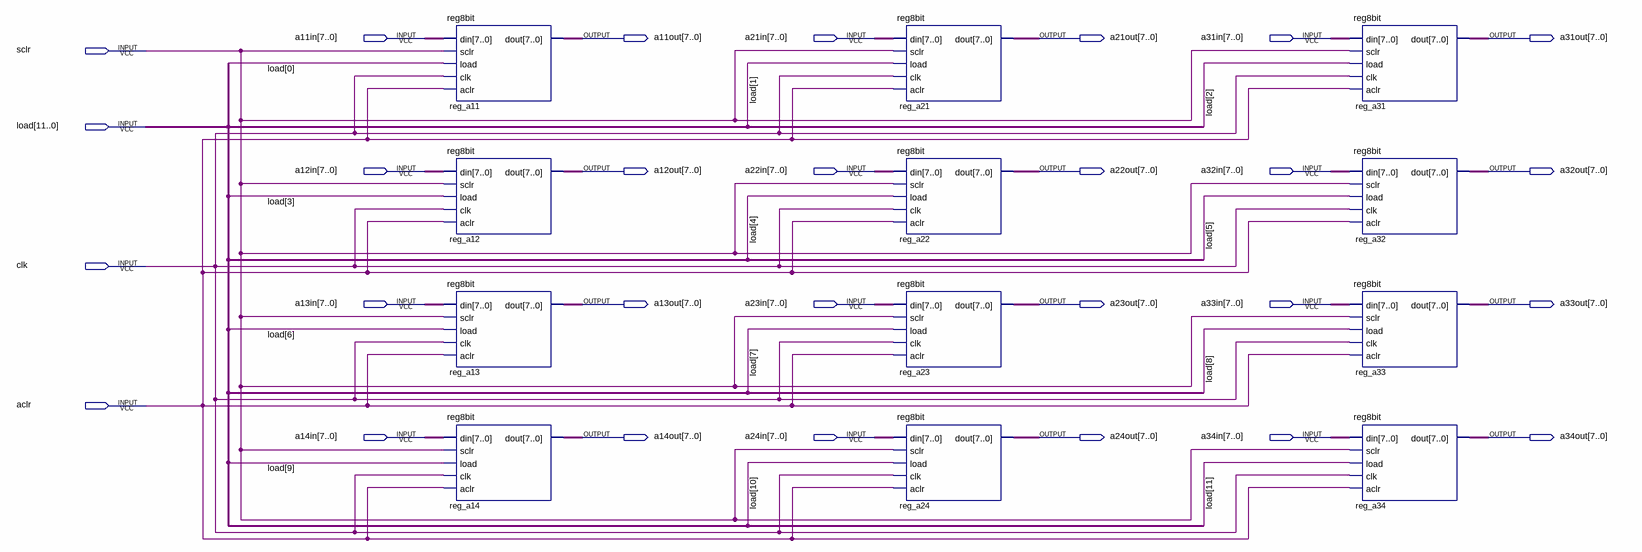
[diagram p0: schematic sheet]
// Quartus schematic matrix_register(old).bdf as structural Verilog: 12 symbols, 28 pins
module \matrix_register(old)  (
  input  [7:0] a11in,
  input  [7:0] a21in,
  input  [7:0] a31in,
  input  sclr,
  input  [11:0] load,
  input  [7:0] a12in,
  input  [7:0] a22in,
  input  [7:0] a32in,
  input  clk,
  input  [7:0] a13in,
  input  [7:0] a23in,
  input  [7:0] a33in,
  input  aclr,
  input  [7:0] a14in,
  input  [7:0] a24in,
  input  [7:0] a34in,
  output [7:0] a11out,
  output [7:0] a21out,
  output [7:0] a31out,
  output [7:0] a12out,
  output [7:0] a22out,
  output [7:0] a32out,
  output [7:0] a13out,
  output [7:0] a23out,
  output [7:0] a33out,
  output [7:0] a14out,
  output [7:0] a24out,
  output [7:0] a34out
);

  reg8bit reg_a11 (.din(a11in), .sclr(sclr), .load(load[0]), .clk(clk), .aclr(aclr), .dout(a11out));
  reg8bit reg_a12 (.din(a12in), .sclr(sclr), .load(load[3]), .clk(clk), .aclr(aclr), .dout(a12out));
  reg8bit reg_a13 (.din(a13in), .sclr(sclr), .load(load[6]), .clk(clk), .aclr(aclr), .dout(a13out));
  reg8bit reg_a14 (.din(a14in), .sclr(sclr), .load(load[9]), .clk(clk), .aclr(aclr), .dout(a14out));
  reg8bit reg_a21 (.din(a21in), .sclr(sclr), .load(load[1]), .clk(clk), .aclr(aclr), .dout(a21out));
  reg8bit reg_a22 (.din(a22in), .sclr(sclr), .load(load[4]), .clk(clk), .aclr(aclr), .dout(a22out));
  reg8bit reg_a23 (.din(a23in), .sclr(sclr), .load(load[7]), .clk(clk), .aclr(aclr), .dout(a23out));
  reg8bit reg_a24 (.din(a24in), .sclr(sclr), .load(load[10]), .clk(clk), .aclr(aclr), .dout(a24out));
  reg8bit reg_a31 (.din(a31in), .sclr(sclr), .load(load[2]), .clk(clk), .aclr(aclr), .dout(a31out));
  reg8bit reg_a32 (.din(a32in), .sclr(sclr), .load(load[5]), .clk(clk), .aclr(aclr), .dout(a32out));
  reg8bit reg_a33 (.din(a33in), .sclr(sclr), .load(load[8]), .clk(clk), .aclr(aclr), .dout(a33out));
  reg8bit reg_a34 (.din(a34in), .sclr(sclr), .load(load[11]), .clk(clk), .aclr(aclr), .dout(a34out));
endmodule
